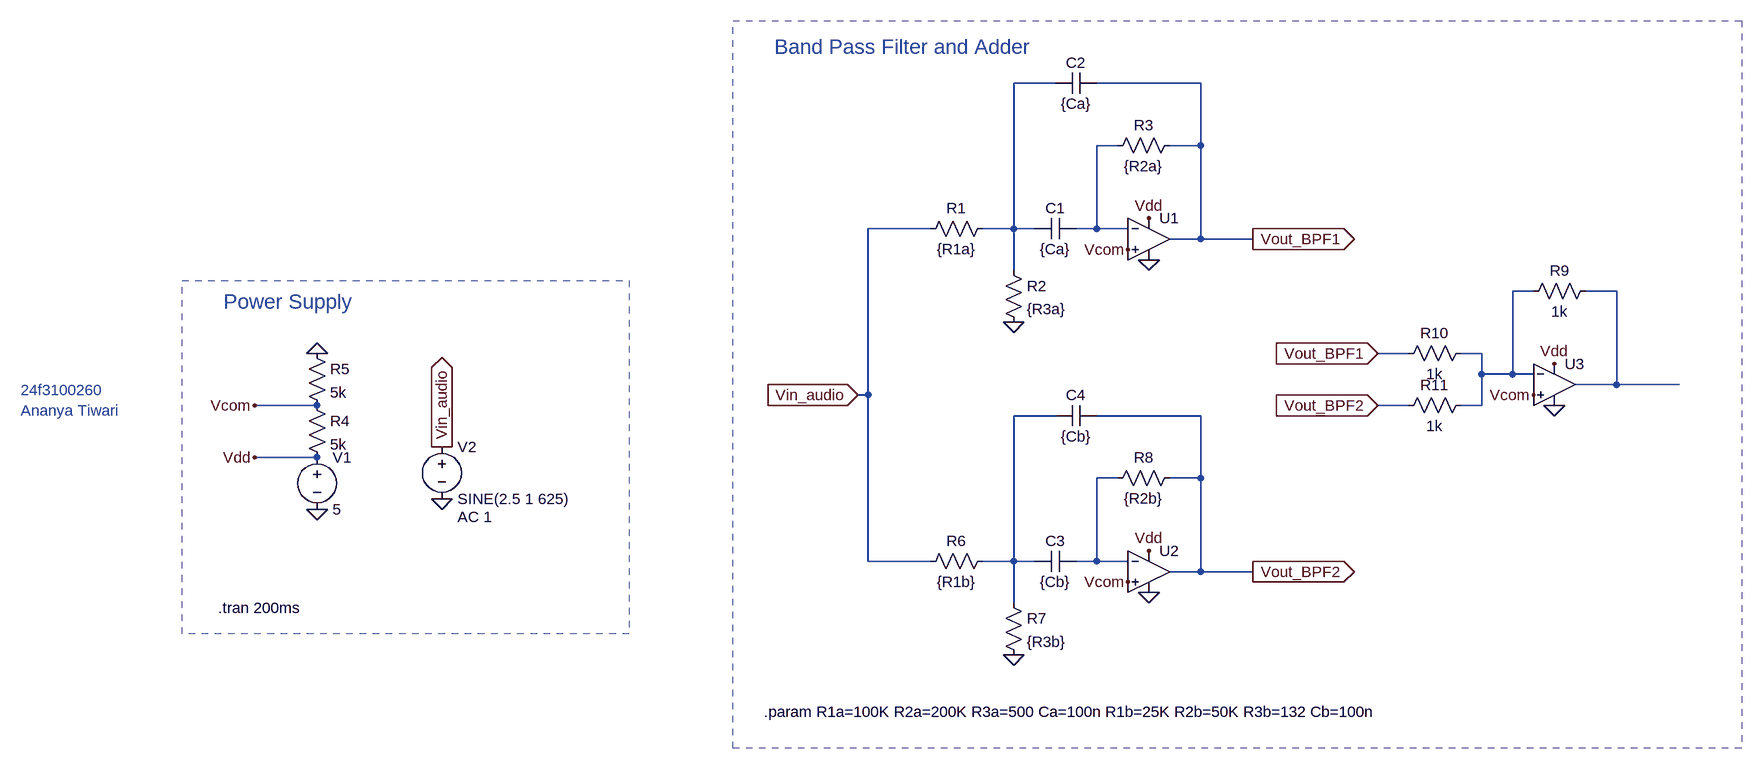
[diagram p0: schematic Analog 5.asc]
Analog 5.asc, the LTspice schematic file:
Version 4.1
SHEET 1 1396 680
WIRE 336 -368 272 -368
WIRE 560 -368 400 -368
WIRE 432 -272 400 -272
WIRE 560 -272 560 -368
WIRE 560 -272 512 -272
WIRE 144 -144 48 -144
WIRE 272 -144 272 -368
WIRE 272 -144 224 -144
WIRE 304 -144 272 -144
WIRE 400 -144 400 -272
WIRE 400 -144 368 -144
WIRE 448 -144 400 -144
WIRE 560 -128 560 -272
WIRE 560 -128 512 -128
WIRE 640 -128 560 -128
WIRE 272 -80 272 -144
WIRE 1072 -48 1040 -48
WIRE 1200 -48 1152 -48
WIRE 880 48 832 48
WIRE 992 48 960 48
WIRE 992 80 992 48
WIRE 1040 80 1040 -48
WIRE 1040 80 992 80
WIRE 1072 80 1040 80
WIRE 1200 96 1200 -48
WIRE 1200 96 1136 96
WIRE 1296 96 1200 96
WIRE 48 112 48 -144
WIRE 48 112 32 112
WIRE -800 128 -896 128
WIRE 880 128 832 128
WIRE 992 128 992 80
WIRE 992 128 960 128
WIRE 336 144 272 144
WIRE 560 144 400 144
WIRE -800 208 -896 208
WIRE 432 240 400 240
WIRE 560 240 560 144
WIRE 560 240 512 240
WIRE 48 368 48 112
WIRE 144 368 48 368
WIRE 272 368 272 144
WIRE 272 368 224 368
WIRE 304 368 272 368
WIRE 400 368 400 240
WIRE 400 368 368 368
WIRE 448 368 400 368
WIRE 560 384 560 240
WIRE 560 384 512 384
WIRE 640 384 560 384
WIRE 272 432 272 368
FLAG -800 288 0
FLAG -800 48 0
FLAG -896 128 Vcom
FLAG -896 208 Vdd
FLAG -608 272 0
FLAG -608 192 Vin_audio
IOPIN -608 192 Out
FLAG 480 -96 0
FLAG 272 0 0
FLAG 480 416 0
FLAG 272 512 0
FLAG 640 -128 Vout_BPF1
IOPIN 640 -128 Out
FLAG 640 384 Vout_BPF2
IOPIN 640 384 Out
FLAG 32 112 Vin_audio
IOPIN 32 112 In
FLAG 448 -112 Vcom
FLAG 448 400 Vcom
FLAG 480 352 Vdd
FLAG 480 -160 Vdd
FLAG 832 48 Vout_BPF1
IOPIN 832 48 In
FLAG 832 128 Vout_BPF2
IOPIN 832 128 In
FLAG 1104 64 Vdd
FLAG 1104 128 0
FLAG 1072 112 Vcom
SYMBOL res 240 -160 R90
WINDOW 0 0 56 VBottom 2
WINDOW 3 32 56 VTop 2
SYMATTR InstName R1
SYMATTR Value {R1a}
SYMBOL res 256 -96 R0
SYMATTR InstName R2
SYMATTR Value {R3a}
SYMBOL cap 304 -160 M90
WINDOW 0 0 32 VBottom 2
WINDOW 3 32 32 VTop 2
SYMATTR InstName C1
SYMATTR Value {Ca}
SYMBOL cap 336 -384 M90
WINDOW 0 0 32 VBottom 2
WINDOW 3 32 32 VTop 2
SYMATTR InstName C2
SYMATTR Value {Ca}
SYMBOL res 528 -288 R90
WINDOW 0 0 56 VBottom 2
WINDOW 3 32 56 VTop 2
SYMATTR InstName R3
SYMATTR Value {R2a}
SYMBOL OpAmps\\UniversalOpAmp2 480 -128 R0
SYMATTR InstName U1
SYMBOL voltage -800 192 R0
WINDOW 123 0 0 Left 0
WINDOW 39 0 0 Left 0
SYMATTR InstName V1
SYMATTR Value 5
SYMBOL res -816 112 R0
SYMATTR InstName R4
SYMATTR Value 5k
SYMBOL res -816 32 R0
SYMATTR InstName R5
SYMATTR Value 5k
SYMBOL res 240 352 R90
WINDOW 0 0 56 VBottom 2
WINDOW 3 32 56 VTop 2
SYMATTR InstName R6
SYMATTR Value {R1b}
SYMBOL res 256 416 R0
SYMATTR InstName R7
SYMATTR Value {R3b}
SYMBOL cap 304 352 M90
WINDOW 0 0 32 VBottom 2
WINDOW 3 32 32 VTop 2
SYMATTR InstName C3
SYMATTR Value {Cb}
SYMBOL cap 336 128 M90
WINDOW 0 0 32 VBottom 2
WINDOW 3 32 32 VTop 2
SYMATTR InstName C4
SYMATTR Value {Cb}
SYMBOL res 528 224 R90
WINDOW 0 0 56 VBottom 2
WINDOW 3 32 56 VTop 2
SYMATTR InstName R8
SYMATTR Value {R2b}
SYMBOL OpAmps\\UniversalOpAmp2 480 384 R0
SYMATTR InstName U2
SYMBOL voltage -608 176 R0
WINDOW 123 24 124 Left 2
WINDOW 39 0 0 Left 0
SYMATTR Value2 AC 1
SYMATTR InstName V2
SYMATTR Value SINE(2.5 1 625)
SYMBOL OpAmps\\UniversalOpAmp2 1104 96 R0
SYMATTR InstName U3
SYMBOL res 1168 -64 R90
WINDOW 0 0 56 VBottom 2
WINDOW 3 32 56 VTop 2
SYMATTR InstName R9
SYMATTR Value 1k
SYMBOL res 976 32 R90
WINDOW 0 0 56 VBottom 2
WINDOW 3 32 56 VTop 2
SYMATTR InstName R10
SYMATTR Value 1k
SYMBOL res 976 112 R90
WINDOW 0 0 56 VBottom 2
WINDOW 3 32 56 VTop 2
SYMATTR InstName R11
SYMATTR Value 1k
TEXT -1256 104 Left 2 ;24f3100260
TEXT -1256 136 Left 2 ;Ananya Tiwari
TEXT -952 440 Left 2 !.tran 200ms
TEXT -944 -32 Left 3 ;Power Supply
TEXT -96 -424 Left 3 ;Band Pass Filter and Adder
TEXT -112 600 Left 2 !.param R1a=100K R2a=200K R3a=500 Ca=100n R1b=25K R2b=50K R3b=132 Cb=100n
RECTANGLE Normal -320 480 -1008 -64 2
RECTANGLE Normal 1392 656 -160 -464 2

The netlist it stands for:
* Analog 5.asc
R1 N001 Vin_audio {R1a}
R2 N001 0 {R3a}
C1 N001 N002 {Ca}
C2 N001 Vout_BPF1 {Ca}
R3 Vout_BPF1 N002 {R2a}
X§U1 Vcom N002 Vdd 0 Vout_BPF1 level2 Avol=1Meg GBW=10Meg Slew=10Meg Ilimit=25m Rail=0 Vos=0 En=0 Enk=0 In=0 Ink=0 Rin=500Meg  ; pins In+ In- V+ V- OUT
V1 Vdd 0 5
R4 Vcom Vdd 5k
R5 0 Vcom 5k
R6 N005 Vin_audio {R1b}
R7 N005 0 {R3b}
C3 N005 N006 {Cb}
C4 N005 Vout_BPF2 {Cb}
R8 Vout_BPF2 N006 {R2b}
X§U2 Vcom N006 Vdd 0 Vout_BPF2 level2 Avol=1Meg GBW=10Meg Slew=10Meg Ilimit=25m Rail=0 Vos=0 En=0 Enk=0 In=0 Ink=0 Rin=500Meg  ; pins In+ In- V+ V- OUT
V2 Vin_audio 0 SINE(2.5 1 625) AC 1
X§U3 Vcom N003 Vdd 0 N004 level2 Avol=1Meg GBW=10Meg Slew=10Meg Ilimit=25m Rail=0 Vos=0 En=0 Enk=0 In=0 Ink=0 Rin=500Meg  ; pins In+ In- V+ V- OUT
R9 N004 N003 1k
R10 N003 Vout_BPF1 1k
R11 N003 Vout_BPF2 1k
* 24f3100260
* Ananya Tiwari
.tran 200ms
* Power Supply
* Band Pass Filter and Adder
.param R1a=100K R2a=200K R3a=500 Ca=100n R1b=25K R2b=50K R3b=132 Cb=100n
.lib UniversalOpAmp2.lib
.backanno
.end